# Altium project pay-lim-switch.PrjPCB
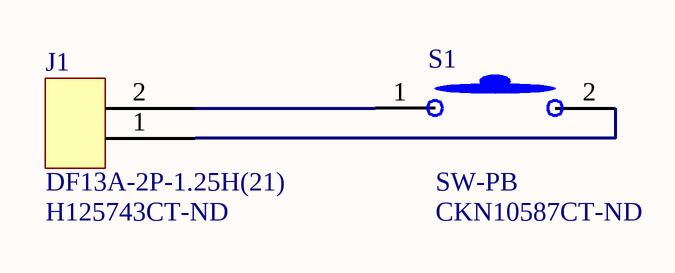
[diagram p0: switch.SchDoc]
1 sheet, 2 parts. Net scope: global (net labels, ports and power ports of the same name join across sheets).
Board file: pay-lim-switch-1.PcbDoc

## Sheet switch.SchDoc
size A4

### Parts
J1  DF13A-2P-1.25H(21)  Supplier Part Number 1: H125743CT-ND  [DF13A-2P-1.25H(21)]
S1  SW-PB  Supplier Part Number 1: CKN10587CT-ND  [PTS830GM140 SMTR LFS - Pushbutton]

### Nets
NetJ1_1: J1.1 S1.2
NetJ1_2: J1.2 S1.1

### Library data of the parts
J1 = DF13A-2P-1.25H(21): 2 pos DF13 right angle surface mount connector; Supplier 1: Digi-Key
S1 = Pushbutton - Low Profile: Schematic symbol for a generic 2-pin pushbutton, OFF-mom.; Supplier 1: Digi-Key